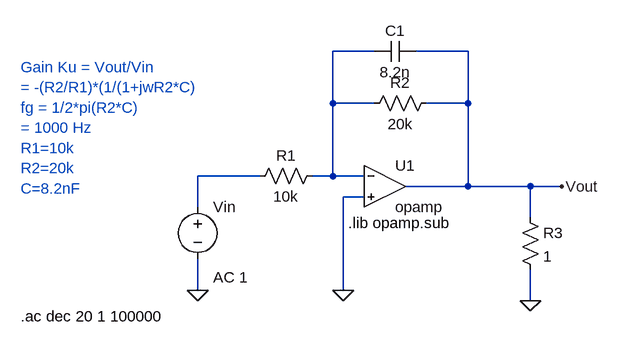
[diagram p0: schematic OpAmpLowPassFilter.asc]
OpAmpLowPassFilter.asc, the LTspice schematic file:
Version 4.1
SHEET 1 880 680
WIRE 416 -96 352 -96
WIRE 560 -96 480 -96
WIRE 352 -16 352 -96
WIRE 416 -16 352 -16
WIRE 560 -16 560 -96
WIRE 560 -16 496 -16
WIRE 240 96 144 96
WIRE 352 96 352 -16
WIRE 352 96 320 96
WIRE 400 96 352 96
WIRE 560 112 560 -16
WIRE 560 112 464 112
WIRE 656 112 560 112
WIRE 704 112 656 112
WIRE 400 128 368 128
WIRE 144 144 144 96
WIRE 656 160 656 112
WIRE 144 272 144 224
WIRE 368 272 368 128
WIRE 656 288 656 240
FLAG 144 272 0
FLAG 368 272 0
FLAG 656 288 0
FLAG 704 112 Vout
SYMBOL voltage 144 128 R0
WINDOW 123 24 124 Left 2
WINDOW 39 0 0 Left 0
SYMATTR InstName Vin
SYMATTR Value ""
SYMATTR Value2 AC 1
SYMBOL res 336 80 R90
WINDOW 0 0 56 VBottom 2
WINDOW 3 32 56 VTop 2
SYMATTR InstName R1
SYMATTR Value 10k
SYMBOL OpAmps\\opamp 432 48 R0
SYMATTR InstName U1
SYMBOL res 512 -32 R90
WINDOW 0 0 56 VBottom 2
WINDOW 3 32 56 VTop 2
SYMATTR InstName R2
SYMATTR Value 20k
SYMBOL cap 480 -112 R90
WINDOW 0 0 32 VBottom 2
WINDOW 3 32 32 VTop 2
SYMATTR InstName C1
SYMATTR Value 8.2n
SYMBOL res 640 144 R0
SYMATTR InstName R3
SYMATTR Value 1
TEXT -128 -72 Left 2 ;Gain Ku = Vout/Vin\n= -(R2/R1)*(1/(1+jwR2*C)\nfg = 1/2*pi(R2*C)\n= 1000 Hz\nR1=10k\nR2=20k\nC=8.2nF
TEXT 376 168 Left 2 !.lib opamp.sub
TEXT -128 312 Left 2 !.ac dec 20 1 100000

The netlist it stands for:
* OpAmpLowPassFilter.asc
Vin N002 0 AC 1
R1 N001 N002 10k
X§U1 N001 0 Vout opamp Aol=100K GBW=10Meg  ; pins invin noninvin out
R2 Vout N001 20k
C1 Vout N001 8.2n
R3 Vout 0 1
* Gain Ku = Vout/Vin
* = -(R2/R1)*(1/(1+jwR2*C)
* fg = 1/2*pi(R2*C)
* = 1000 Hz
* R1=10k
* R2=20k
* C=8.2nF
.lib opamp.sub
.ac dec 20 1 100000
.backanno
.end